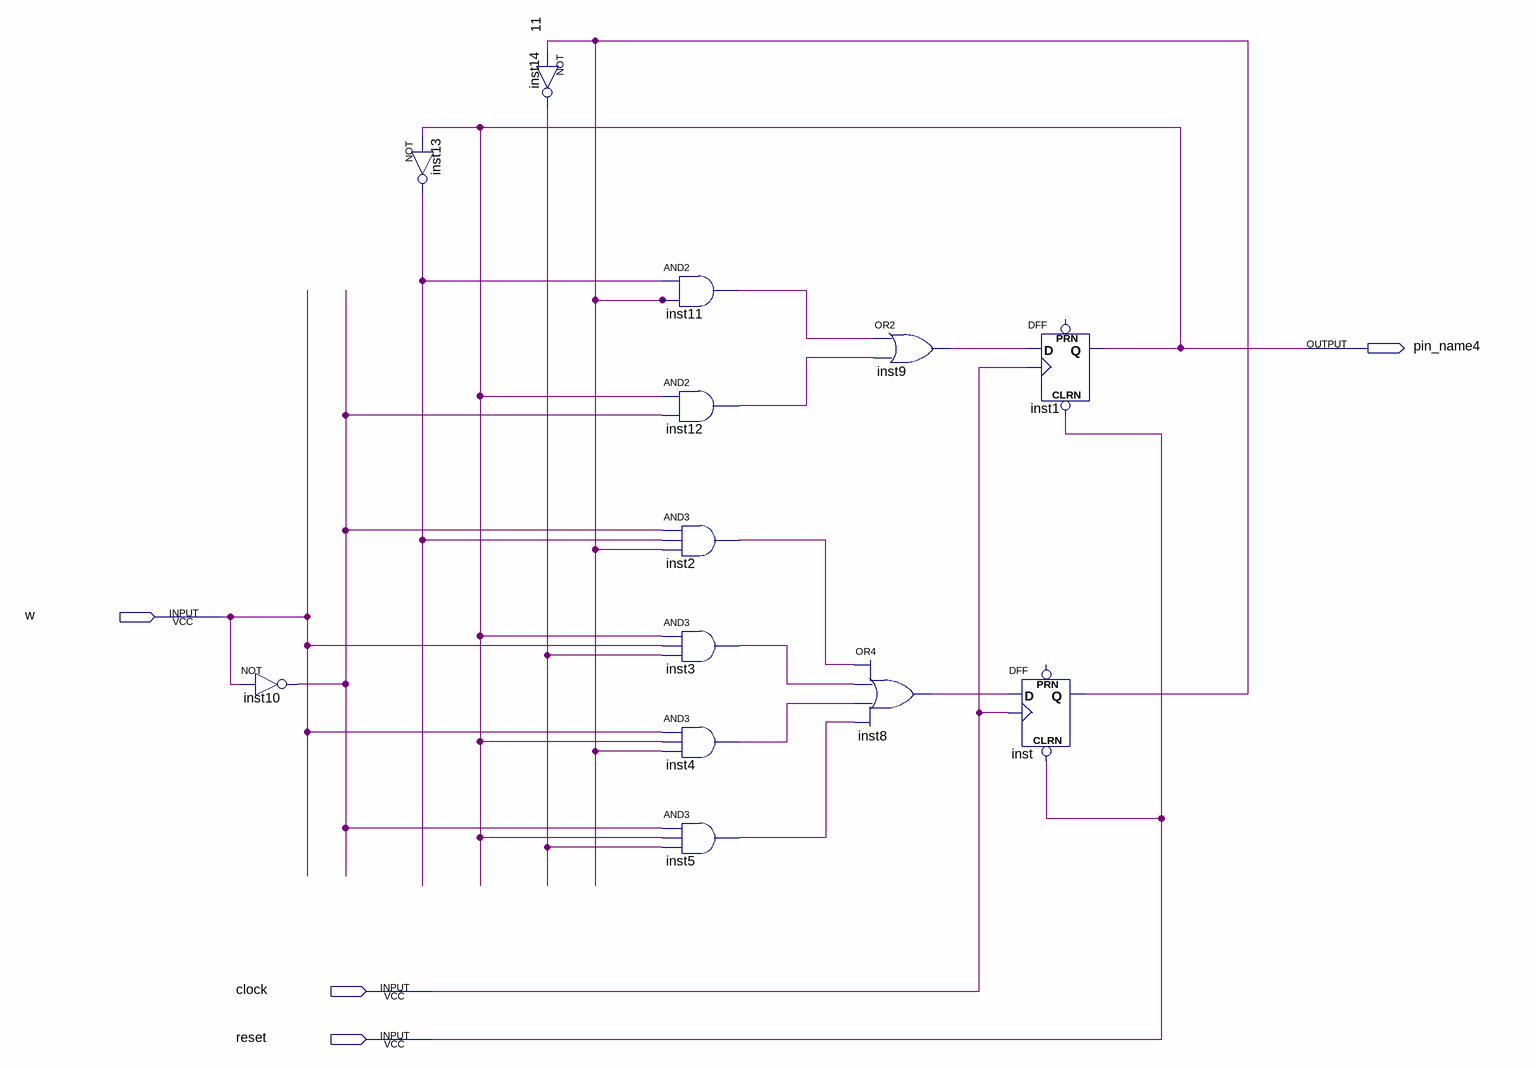
[diagram p0: schematic sheet]
// Quartus schematic Question5.bdf as structural Verilog: 13 symbols, 4 pins
module Question5 (
  input  w,
  input  clock,
  input  reset,
  output pin_name4
);

  wire \11 , inst2_out, inst3_out, inst4_out, inst5_out, inst8_out, inst9_out, inst10_out, inst11_out,
       inst12_out, inst13_out, inst14_out;

  not inst10 (inst10_out, w);
  not inst13 (inst13_out, pin_name4);
  not inst14 (inst14_out, \11 );
  and inst11 (inst11_out, inst13_out, \11 );
  and inst12 (inst12_out, pin_name4, inst10_out);
  and inst2 (inst2_out, inst10_out, inst13_out, \11 );
  and inst3 (inst3_out, pin_name4, w, inst14_out);
  and inst4 (inst4_out, w, pin_name4, \11 );
  and inst5 (inst5_out, inst10_out, pin_name4, inst14_out);
  or inst9 (inst9_out, inst11_out, inst12_out);
  or inst8 (inst8_out, inst2_out, inst3_out, inst4_out, inst5_out);
  DFF inst1 (.CLRN(reset), .CLK(clock), .D(inst9_out), .Q(pin_name4));  // open: PRN
  DFF inst (.CLRN(reset), .CLK(clock), .D(inst8_out), .Q(\11 ));  // open: PRN
endmodule
